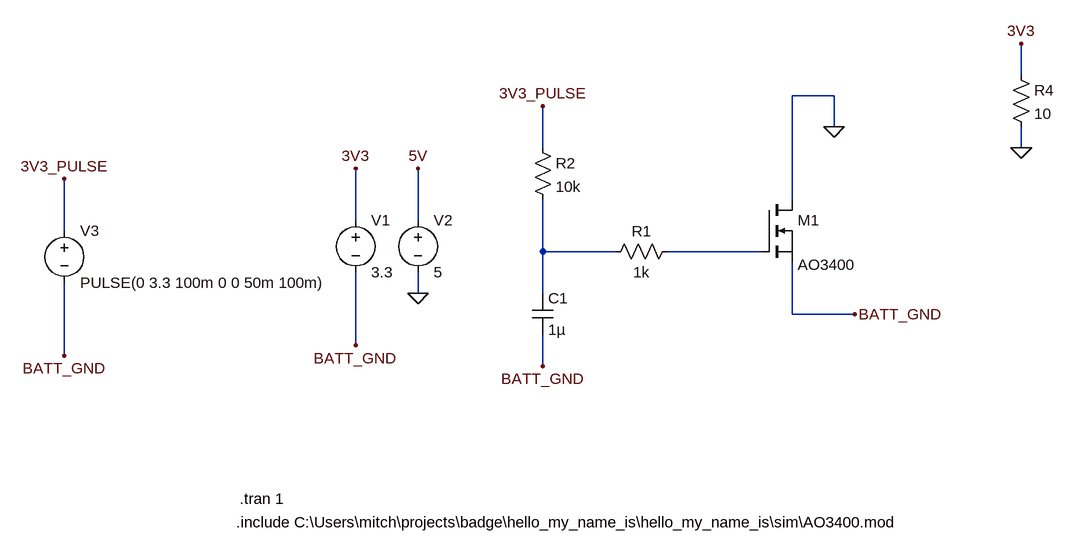
[diagram p0: schematic badge.asc]
badge.asc, the LTspice schematic file:
Version 4
SHEET 1 1272 680
WIRE 528 -80 528 -128
WIRE 240 -48 176 -48
WIRE 240 0 240 -48
WIRE -208 32 -208 -32
WIRE 528 32 528 0
WIRE 176 112 176 -48
WIRE -496 144 -496 64
WIRE -400 144 -400 64
WIRE -944 160 -944 80
WIRE -208 192 -208 112
WIRE -96 192 -208 192
WIRE 128 192 -16 192
WIRE -400 256 -400 224
WIRE -208 256 -208 192
WIRE 176 288 176 208
WIRE 272 288 176 288
WIRE -496 336 -496 224
WIRE -944 352 -944 240
WIRE -208 368 -208 320
FLAG 272 288 BATT_GND
FLAG -496 64 3V3
FLAG -400 256 0
FLAG -400 64 5V
FLAG -496 336 BATT_GND
FLAG -208 -32 3V3_PULSE
FLAG -208 368 BATT_GND
FLAG 528 32 0
FLAG 528 -128 3V3
FLAG 240 0 0
FLAG -944 352 BATT_GND
FLAG -944 80 3V3_PULSE
SYMBOL nmos 128 112 R0
WINDOW 3 56 72 Invisible 2
WINDOW 38 56 100 Left 2
SYMATTR InstName M1
SYMATTR Value ""
SYMATTR Prefix X
SYMATTR SpiceModel AO3400
SYMBOL res 0 176 R90
WINDOW 0 0 56 VBottom 2
WINDOW 3 32 56 VTop 2
SYMATTR InstName R1
SYMATTR Value 1k
SYMBOL res -224 16 R0
SYMATTR InstName R2
SYMATTR Value 10k
SYMBOL voltage -496 128 R0
WINDOW 123 0 0 Left 0
WINDOW 39 0 0 Left 0
SYMATTR InstName V1
SYMATTR Value 3.3
SYMBOL voltage -400 128 R0
WINDOW 123 0 0 Left 0
WINDOW 39 0 0 Left 0
SYMATTR InstName V2
SYMATTR Value 5
SYMBOL res 512 -96 R0
SYMATTR InstName R4
SYMATTR Value 10
SYMBOL voltage -944 144 R0
WINDOW 123 0 0 Left 0
WINDOW 39 0 0 Left 0
SYMATTR InstName V3
SYMATTR Value PULSE(0 3.3 100m 0 0 50m 100m)
SYMBOL cap -224 256 R0
SYMATTR InstName C1
SYMATTR Value 1µ
TEXT -680 608 Left 2 !.include C:\\Users\\mitch\\projects\\badge\\hello_my_name_is\\hello_my_name_is\\sim\\AO3400.mod
TEXT -674 572 Left 2 !.tran 1

The netlist it stands for:
* badge.asc
XM1 0 N002 BATT_GND AO3400  ; pins D G S
R1 N002 N001 1k
R2 3V3_PULSE N001 10k
V1 3V3 BATT_GND 3.3
V2 5V 0 5
R4 3V3 0 10
V3 3V3_PULSE BATT_GND PULSE(0 3.3 100m 0 0 50m 100m)
C1 N001 BATT_GND 1µ
.include C:\Users\mitch\projects\badge\hello_my_name_is\hello_my_name_is\sim\AO3400.mod
.tran 1
.backanno
.end

* Results of the author's LTspice run, read from the files saved beside the schematic
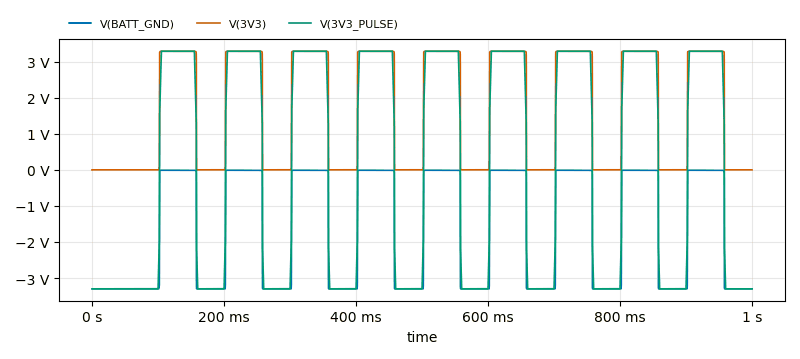
[diagram p1: Transient Analysis of badge.asc, plotted from the saved traces]
* Transient Analysis, 1 run:
*   V(BATT_GND): min -3.3 V, max -10.37 mV, average -1.645 V, rms 2.324 V, last -3.3 V
*   V(3V3): min -19.49 µV, max 3.29 V, average 1.655 V, rms 2.331 V, last 0 V
*   V(3V3_PULSE): min -3.3 V, max 3.29 V, average -11.11 mV, rms 3.229 V, last -3.3 V